# EAGLE design i2c_board (EAGLE 8.4.1)
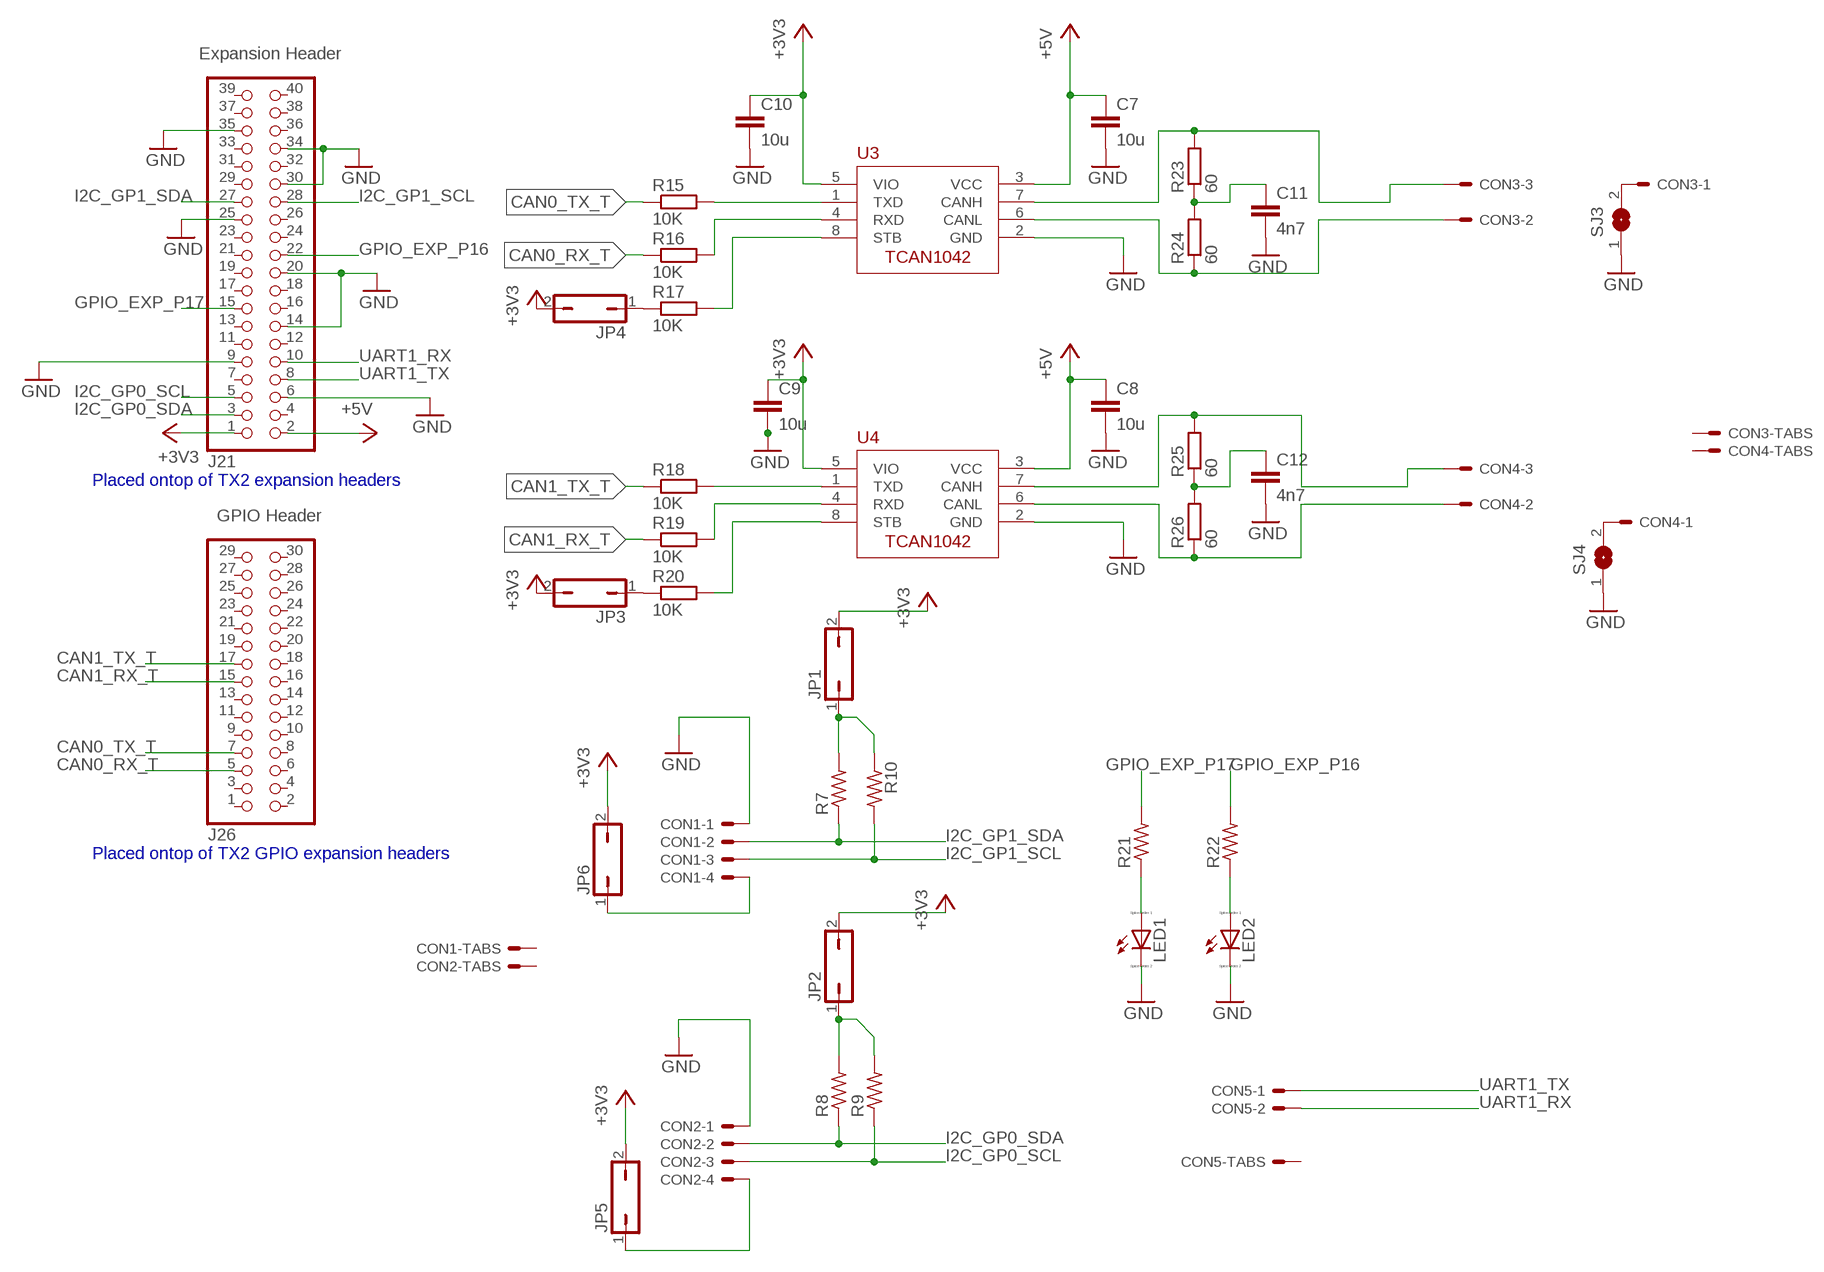
[diagram p0: schematic, sheet 1]

## Parts
C7  10u  C-EUC0805  [C0805]
C8  10u  C-EUC0805  [C0805]
C9  10u  C-EUC0805  [C0805]
C10  10u  C-EUC0805  [C0805]
C11  4n7  C-EUC0805  [C0805]
C12  4n7  C-EUC0805  [C0805]
CON1  SM04B-GHS-TB  [SM04B-GHS-TB]
CON2  SM04B-GHS-TB  [SM04B-GHS-TB]
CON3  SM03B-GHS-TB  [SM03B-GHS-TB]
CON4  SM03B-GHS-TB  [SM03B-GHS-TB]
CON5  SM02B-GHS-TB  [SM02B-GHS-TB]
J21  PINHD-2X20  [2X20]
J26  PINHD-2X15  [2X15]
JP1  JP1Q  [JP1]
JP2  JP1Q  [JP1]
JP3  JP1Q  [JP1]
JP4  JP1Q  [JP1]
JP5  JP1Q  [JP1]
JP6  JP1Q  [JP1]
LED1  LED_E  [LED_1206]
LED2  LED_E  [LED_1206]
R7  R-US_M1206  [M1206]
R8  R-US_M1206  [M1206]
R9  R-US_M1206  [M1206]
R10  R-US_M1206  [M1206]
R15  10K  R-EU_R0805  [R0805]
R16  10K  R-EU_R0805  [R0805]
R17  10K  R-EU_R0805  [R0805]
R18  10K  R-EU_R0805  [R0805]
R19  10K  R-EU_R0805  [R0805]
R20  10K  R-EU_R0805  [R0805]
R21  R-US_M1206  [M1206]
R22  R-US_M1206  [M1206]
R23  60  R-EU_R1206  [R1206]
R24  60  R-EU_R1206  [R1206]
R25  60  R-EU_R1206  [R1206]
R26  60  R-EU_R1206  [R1206]
SJ3  SJ  [SJ]
SJ4  SJ  [SJ]
U3  TCAN1042HVDR  [SO-8]
U4  TCAN1042HVDR  [SO-8]

## Nets
+3V3: C9.1 C10.1 J21.1 JP1.2 JP2.2 JP3.2 JP4.2 JP5.2 JP6.2 U3.5(VIO) U4.5(VIO)
+5V: C7.1 C8.1 J21.2 U3.3(VCC) U4.3(VCC)
CAN0_RX_T: J26.5 R16.1
CAN0_TX_T: J26.7 R15.1
CAN1_RX_T: J26.15 R19.1
CAN1_TX_T: J26.17 R18.1
GND: C7.2 C8.2 C9.2 C10.2 C11.2 C12.2 CON1.P$1 CON2.P$1 J21.6 J21.9 J21.14 J21.20 J21.25 J21.30 J21.34 J21.35 LED1.C LED2.C SJ3.1 SJ4.1 U3.2(GND) U4.2(GND)
GPIO_EXP_P16: J21.22 R22.2
GPIO_EXP_P17: J21.15 R21.2
I2C_GP0_SCL: CON2.P$3 J21.5 R9.1
I2C_GP0_SDA: CON2.P$2 J21.3 R8.1
I2C_GP1_SCL: CON1.P$3 J21.28 R10.2
I2C_GP1_SDA: CON1.P$2 J21.27 R7.1
N$1: JP2.1 R8.2 R9.2
N$2: JP1.1 R7.2 R10.1
N$3: LED1.A R21.1
N$4: LED2.A R22.1
N$5: CON1.P$4 JP6.1
N$6: CON2.P$4 JP5.1
N$19: C11.1 R23.1 R24.2
N$20: C12.1 R25.1 R26.2
N$21: CON4.P$3 R25.2 U4.7(CANH)
N$22: CON4.P$2 R26.1 U4.6(CANL)
N$23: CON3.P$3 R23.2 U3.7(CANH)
N$24: CON3.P$2 R24.1 U3.6(CANL)
N$25: R15.2 U3.1(TXD)
N$26: R16.2 U3.4(RXD)
N$27: R17.2 U3.8(STB)
N$28: R18.2 U4.1(TXD)
N$29: R19.2 U4.4(RXD)
N$30: R20.2 U4.8(STB)
N$31: CON3.P$1 SJ3.2
N$32: CON4.P$1 SJ4.2
N$33: JP4.1 R17.1
N$34: JP3.1 R20.1
UART1_RX: CON5.P$2 J21.10
UART1_TX: CON5.P$1 J21.8
Unconnected: CON1.P$5 CON1.P$6 CON2.P$5 CON2.P$6 CON3.P$4 CON3.P$5 CON4.P$4 CON4.P$5 CON5.P$3 CON5.P$4 J21.4 J21.7 J21.11 J21.12 J21.13 J21.16 J21.17 J21.18 J21.19 J21.21 J21.23 J21.24 J21.26 J21.29 J21.31 J21.32 J21.33 J21.36 J21.37 J21.38 J21.39 J21.40 J26.1 J26.2 J26.3 J26.4 J26.6 J26.8 J26.9 J26.10 J26.11 J26.12 J26.13 J26.14 J26.16 J26.18 J26.19 J26.20 J26.21 J26.22 J26.23 J26.24 J26.25 J26.26 J26.27 J26.28 J26.29 J26.30

## Notes on the sheet
- Expansion Header
- Placed ontop of TX2 expansion headers
- GPIO Header
- Placed ontop of TX2 GPIO expansion headers

## Library data of the parts
C7-C12 = resistor:C-EU: CAPACITOR, European symbol
CON1 CON2 = ARVP:SM04B-GHS-TB
CON3 CON4 = ARVP:SM03B-GHS-TB
CON5 = ARVP:SM02B-GHS-TB
J21 = commhub:PINHD-2X20: PIN HEADER
J26 = commhub:PINHD-2X15: PIN HEADER
JP1-JP6 = jumper:JP1Q: JUMPER
LED1 LED2 = eagle-ltspice:LED_E: LED Source: http://www.osram.convergy.de Source: www.luxeon.com Source: www.kingbright.com; SPICEMODEL: NONE; SPICEPREFIX: D; SPICETYPE: diode
R7-R10 R21 R22 = resistor:R-US_: RESISTOR, American symbol
R15-R20 R23-R26 = resistor:R-EU_: RESISTOR, European symbol
SJ3 SJ4 = jumper:SJ: SMD solder JUMPER
U3 U4 = ARVP:TCAN1042HVDR

## Board
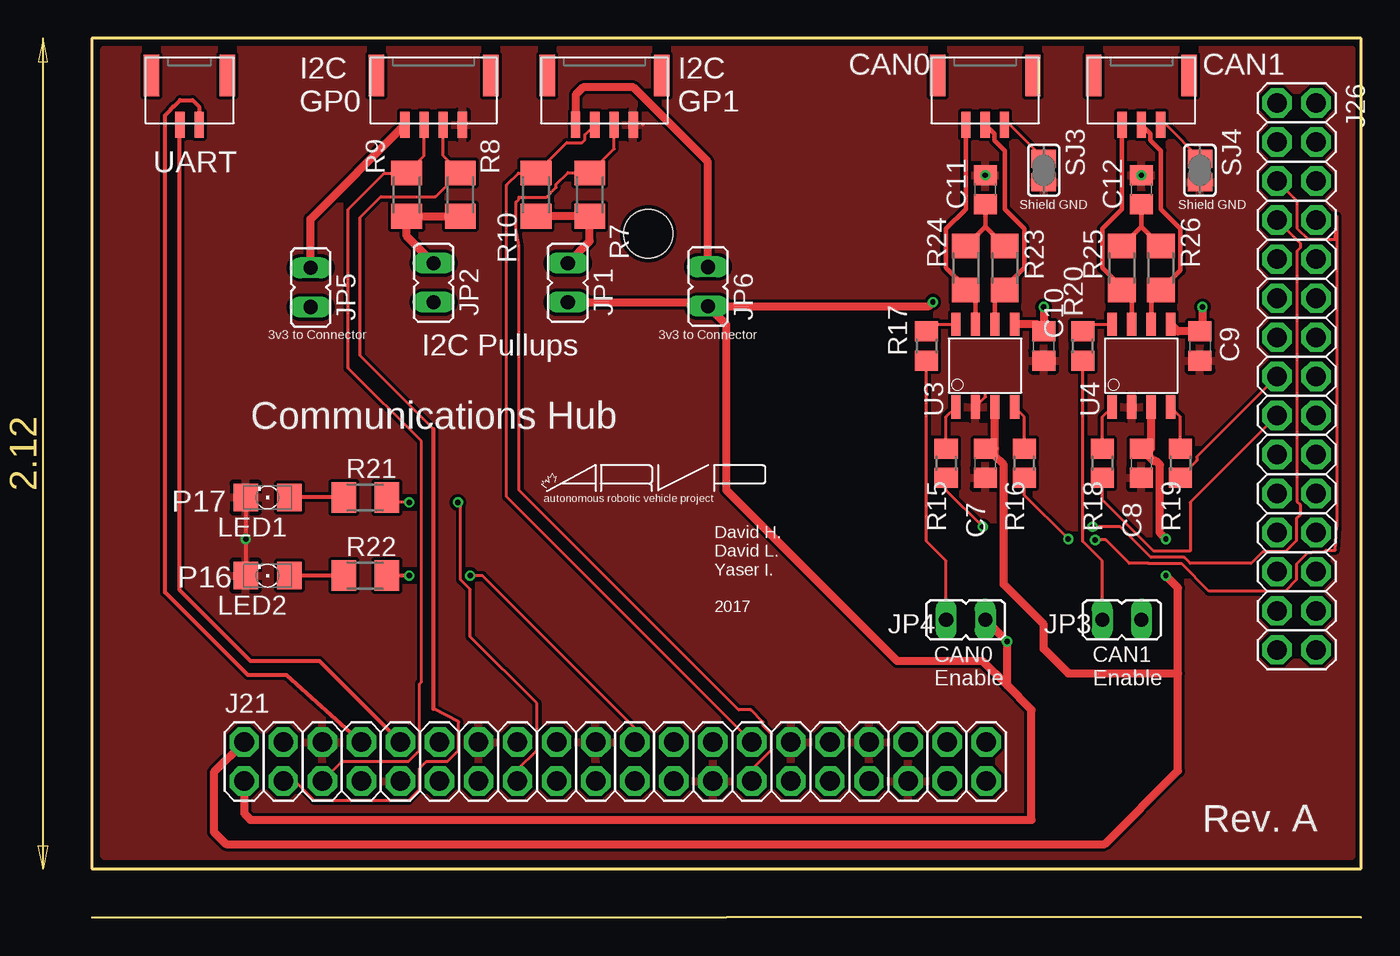
[diagram p1: board, top side]
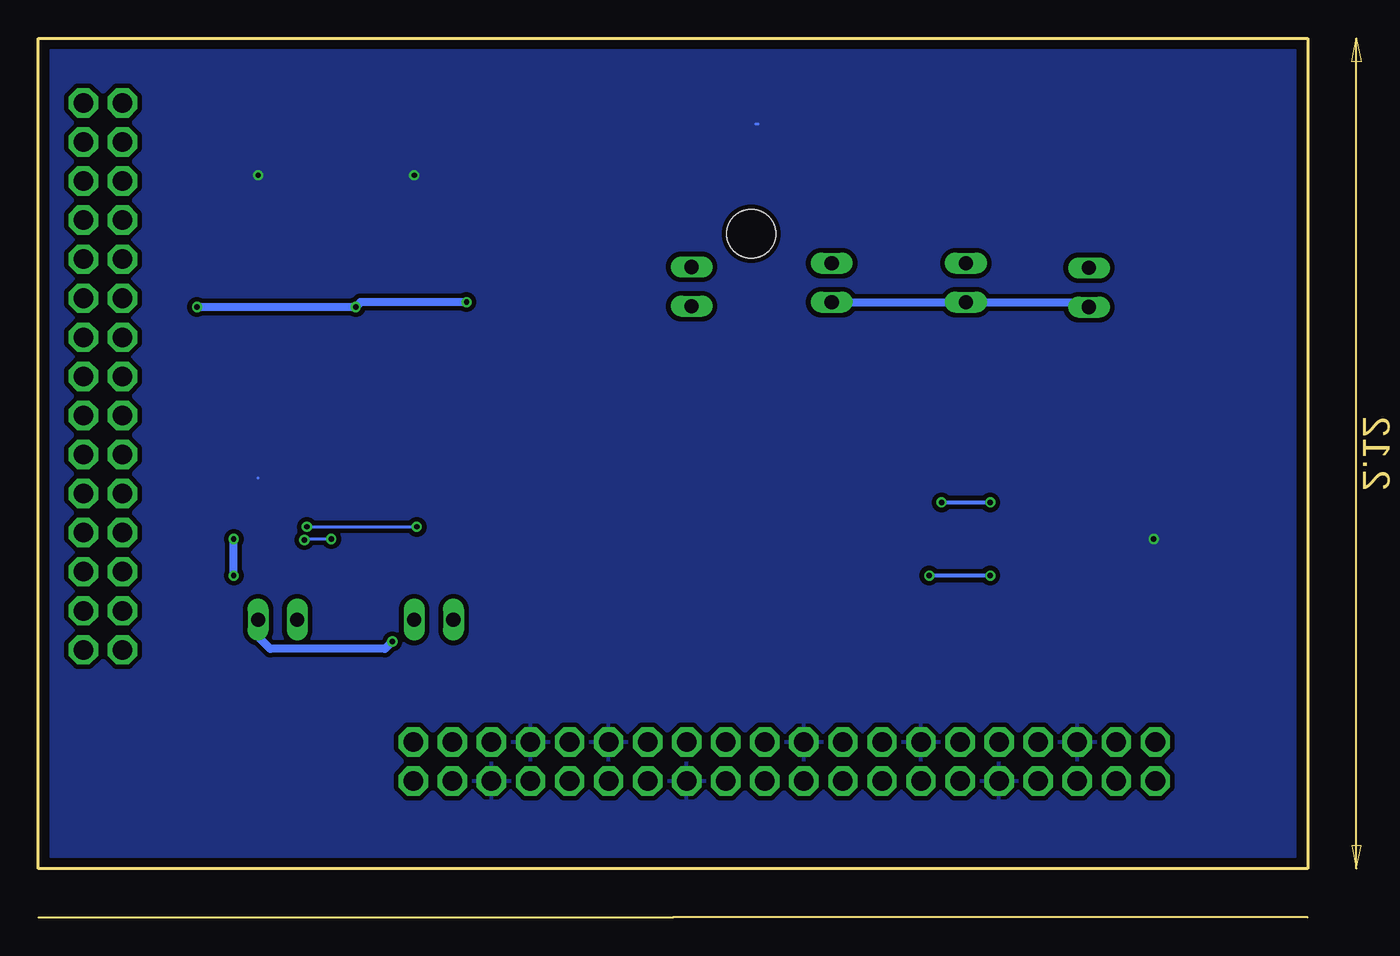
[diagram p2: board, bottom side, seen from below]

Size 82.55 x 53.98 mm. Coordinates in mm from the lower left corner, seen from the top.
Outline: 0,0 82.55,0 82.55,53.98 0,53.98 0,0
Copper layers (1*16): Top 0.035mm / dielectric 1.5mm / Bottom 0.035mm
Design rules "ITEADstudioDRC": minimum track width 6mil, minimum drill 12mil, track to track 8mil, track to pad 8mil, pad to pad 8mil, via to via 8mil, smd to smd 0mil, copper to edge 10mil, drill to drill 10mil, minimum pad ring 6mil, minimum via ring 6mil, stop-mask expansion 2mil, vias tented up to drill 100mil, thermal gap 10mil
Holes 3.17 mm at 36.2,41.27

### Footprints (pad centres in the part's own frame; a part is rotated, then mirrored left to right if it is on the bottom)
C0805 = smd 1.3 x 1.5: 1 -0.95,0; 2 0.95,0
SM04B-GHS-TB = smd 0.6 x 1.7: P$1 -1.875,0.85; P$2 -0.625,0.85; P$3 0.625,0.85; P$4 1.875,0.85 | smd 1 x 2.7: P$5 -3.725,-2.35; P$6 3.725,-2.35
SM03B-GHS-TB = smd 0.6 x 1.7: P$1 -1.25,0.85; P$2 0,0.85; P$3 1.25,0.85 | smd 1 x 2.7: P$4 -3.1,-2.35; P$5 3.1,-2.35
SM02B-GHS-TB = smd 0.6 x 1.7: P$1 -0.625,0.85; P$2 0.625,0.85 | smd 1 x 2.7: P$3 -2.475,-2.35; P$4 2.475,-2.35
2X20 = drill 1.27 octagon: 1 -24.13,-1.27; 2 -24.13,1.27; 3 -21.59,-1.27; 4 -21.59,1.27; 5 -19.05,-1.27; 6 -19.05,1.27; 7 -16.51,-1.27; 8 -16.51,1.27; 9 -13.97,-1.27; 10 -13.97,1.27; 11 -11.43,-1.27; 12 -11.43,1.27; 13 -8.89,-1.27; 14 -8.89,1.27; 15 -6.35,-1.27; 16 -6.35,1.27; 17 -3.81,-1.27; 18 -3.81,1.27; 19 -1.27,-1.27; 20 -1.27,1.27; 21 1.27,-1.27; 22 1.27,1.27; 23 3.81,-1.27; 24 3.81,1.27; 25 6.35,-1.27; 26 6.35,1.27; 27 8.89,-1.27; 28 8.89,1.27; 29 11.43,-1.27; 30 11.43,1.27; 31 13.97,-1.27; 32 13.97,1.27; 33 16.51,-1.27; 34 16.51,1.27; 35 19.05,-1.27; 36 19.05,1.27; 37 21.59,-1.27; 38 21.59,1.27; 39 24.13,-1.27; 40 24.13,1.27
2X15 = drill 1.27 octagon: 1 -17.78,-1.27; 2 -17.78,1.27; 3 -15.24,-1.27; 4 -15.24,1.27; 5 -12.7,-1.27; 6 -12.7,1.27; 7 -10.16,-1.27; 8 -10.16,1.27; 9 -7.62,-1.27; 10 -7.62,1.27; 11 -5.08,-1.27; 12 -5.08,1.27; 13 -2.54,-1.27; 14 -2.54,1.27; 15 0,-1.27; 16 0,1.27; 17 2.54,-1.27; 18 2.54,1.27; 19 5.08,-1.27; 20 5.08,1.27; 21 7.62,-1.27; 22 7.62,1.27; 23 10.16,-1.27; 24 10.16,1.27; 25 12.7,-1.27; 26 12.7,1.27; 27 15.24,-1.27; 28 15.24,1.27; 29 17.78,-1.27; 30 17.78,1.27
JP1 = drill 0.914 long: 1 0,-1.27; 2 0,1.27
LED_1206 = smd 1.6 x 1.803: A -1.422,0; C 1.422,0
M1206 = smd 1.6 x 2: 1 -1.4,0; 2 1.4,0
R0805 = smd 1.3 x 1.5: 1 -0.95,0; 2 0.95,0
R1206 = smd 1.6 x 1.803: 1 -1.422,0; 2 1.422,0
SJ = smd 1.168 x 1.6: 1 -0.762,0; 2 0.762,0
SO-8 = smd 1.524 x 0.61: 1 -2.692,1.905; 2 -2.692,0.635; 3 -2.692,-0.635; 4 -2.692,-1.905; 5 2.692,-1.905; 6 2.692,-0.635; 7 2.692,0.635; 8 2.692,1.905

### Placement (x,y rotation side)
C7  58.1,26.35 270 top
C8  68.26,26.35 270 top
C9  72.07,33.97 270 top
C10  61.91,33.97 270 top
C11  58.1,44.13 90 top
C12  68.26,44.13 90 top
CON1  33.34,49.21 180 top
CON2  22.23,49.21 180 top
CON3  58.1,49.21 180 top
CON4  68.26,49.21 180 top
CON5  6.35,49.21 180 top
J21  34.04,6.96 0 top
J26  78.36,32 270 top
JP1  30.96,38.1 180 top
JP2  22.23,38.1 180 top
JP3  66.99,16.19 270 top
JP4  56.83,16.19 270 top
JP5  14.22,37.78 180 top
JP6  40.07,37.85 180 top
LED1  11.43,24.13 180 top
LED2  11.43,19.05 180 top
R7  32.38,43.81 270 top
R8  23.97,43.81 270 top
R9  20.48,43.81 270 top
R10  28.89,43.81 90 top
R15  55.56,26.35 90 top
R16  60.64,26.35 90 top
R17  54.29,33.97 90 top
R18  65.72,26.35 90 top
R19  70.8,26.35 90 top
R20  64.45,33.97 90 top
R21  17.78,24.13 0 top
R22  17.78,19.05 0 top
R23  56.83,39.05 270 top
R24  59.37,39.05 90 top
R25  66.99,39.05 270 top
R26  69.53,39.05 90 top
SJ3  61.91,45.4 90 top
SJ4  72.07,45.4 90 top
U3  58.1,32.7 90 top
U4  68.26,32.7 90 top
U$1  [ARVP]  29.37,23.81 0 top

### Tracks (layer width: path | path; a pad name or v marks a point on that pad's centre or on a via)
+3V3  (via drill 0.35)
  Top 0.305: C10.1
  Top 0.508: 9.87,4.9 J21.1 9.91,3.59 10.32,3.17 61.12,3.17 61.12,10.32 59.53,11.91 | 59.53,11.91 v59.53,14.76 JP4.2 | 59.53,11.91 57.94,13.49 52.39,13.49 41.27,24.61 41.27,35.37 JP6.2 | v61.91,36.51 C10.1 | C10.1 61.44,35.4 U3.5 | v72.23,36.51 72.23,35.08 C9.1 70.64,34.92 U4.5 | JP1.2 39.81,36.83 JP6.2 | JP6.2 54.45,36.58 v54.71,36.83
  Bottom 0.508: v59.53,14.76 60.01,14.29 67.47,14.29 68.26,15.08 JP3.2 | JP1.2 JP2.2 14.54,36.83 JP5.2 | v54.71,36.83 61.59,36.83 v61.91,36.51 v72.23,36.51
+5V  (via drill 0.35)
  Top 0.406: C8.1 68.9,27.3 | 58.74,27.3 C7.1
  Top 0.508: 68.9,27.3 U4.3 | U3.3 58.74,27.3 58.74,26.81 59.31,26.24 59.31,18.48 61.91,15.88 61.91,14.29 63.5,12.7 70.64,12.7 | J21.2 7.94,6.26 7.94,2.38 8.73,1.59 65.88,1.59 70.64,6.35 70.64,12.7 | v69.85,19.05 70.64,18.26 70.64,12.7 | C8.1 69.06,26.51 69.2,26.51 69.47,26.24 69.47,21.81 v69.85,21.43
  Bottom 0.508: v69.85,19.05 v69.85,21.43
CAN0_RX_T  (via drill 0.35)
  Top 0.203: J26.5 78.37,43.42 78.37,41.64 79.11,40.91 80.89,40.91 80.96,42.42 80.96,22.23 80.89,20.71 80.28,20.71 80.15,20.59 79.38,20.59 79.36,20.56 79.11,20.56 78.35,19.8 78.35,18.78 77.61,18.05 72.66,18.05 70.88,19.82 68.72,19.82 68.7,19.84 67.47,19.84 65.94,21.37 v65.25,21.37 | v63.5,21.43 60.64,24.29 R16.1
  Bottom 0.203: v65.25,21.37 65.19,21.43 v63.5,21.43
CAN0_TX_T  (via drill 0.35)
  Top 0.203: J26.7 78.58,40.67 78.58,40.35 78.37,40.15 78.37,23.86 78.58,23.65 78.58,23.02 78.35,22.78 78.35,21.32 77.61,20.59 76.15,20.59 75.41,19.84 71.44,19.84 71.05,20.23 68.89,20.23 66.89,22.23 v65.09,22.23 | v57.94,22.23 55.56,24.61 R15.1
  Bottom 0.203: v65.09,22.23 v57.94,22.23
CAN1_RX_T
  Top 0.203: J26.15 71.86,26.77 71.86,26.53 70.8,25.47 R19.1
CAN1_TX_T
  Top 0.203: J26.17 71.44,23.81 71.44,20.64 69.06,20.64 65.72,23.97 R18.1
GND  (via drill 0.35)
  Top 0.203: 35.82,48.36 35.88,48.42 | U3.2 58.13,30.67 58.13,30.9
  Top 0.254: LED1.C v10.01,21.43 LED2.C
  Bottom 0.203: 35.88,48.42 35.72,48.42 | C8.2 | C11.2 57.94,45.24 | C12.2 68.26,45.24
  other vias: 58.1,45.08 68.26,45.08
  pour Bottom (isolate 0.305): 0.79,53.18 81.76,53.18 81.76,0.79 0.79,0.79
  pour Top: 0.82,53.24 81.92,53.24 81.92,0.82 0.82,0.82
GPIO_EXP_P16  (via drill 0.35)
  Top 0.203: J21.22 35.31,9.14 25.4,19.05 v24.61,19.05
  Top 0.254: v20.64,19.05 R22.2
  Bottom 0.254: v20.64,19.05 v24.61,19.05
GPIO_EXP_P17  (via drill 0.35)
  Top 0.203: v23.81,23.81 23.97,23.65 23.97,18.79 24.61,18.16 24.61,15.08 28.94,10.74 28.94,7.71 27.69,6.45 J21.15 | v20.64,23.81 19.5,23.81 R21.2
  Top 0.254: 27.69,6.45 J21.15
  Bottom 0.254: v23.81,23.81 v20.64,23.81
I2C_GP0_SCL
  Top 0.203: CON2.P$3 21.6,46.34 R9.1 19.02,45.22 16.67,42.86 16.67,32.54 21.43,27.78 21.43,12.13 21.32,12.03 21.32,7.71 20.59,6.97 16.27,6.97 J21.5
I2C_GP0_SDA
  Top 0.203: CON2.P$2 22.85,46.34 R8.1 23.88,45.22 | J21.3 13.21,5.69 14.46,4.43 20.59,4.43 21.32,5.17 21.32,6.53 21.76,6.97 23.13,6.97 23.86,7.71 23.86,9.54 22.23,10.39 | 22.23,28.57 17.46,33.34 17.46,42.35 18.8,43.69 22.35,43.69 23.88,45.22 | 23.88,45.22 23.37,45.22
  Top 0.254: 22.23,10.39 22.23,28.57
I2C_GP1_SCL
  Top 0.203: CON1.P$3 32.07,47.72 32.07,47.39 31.89,47.21 30.89,47.21 R10.2 27.75,45.22 26.99,44.45 26.99,24.17 J21.28
I2C_GP1_SDA
  Top 0.203: J21.27 42.93,6.45 44.21,7.73 44.21,8.73 | CON1.P$2 33.96,46.79 R7.1 32.36,45.24 30.96,45.24 30.2,44.48 30.2,44.29 29.57,43.66 27.78,43.66 27.78,43.53 27.59,43.34 27.59,41.49 27.78,40.5 27.78,24.61 42.07,10.32 42.86,10.32 43.66,9.53 43.66,9.28 44.21,8.73 | 44.21,8.73 44.21,8.75
N$1
  Top 0.508: JP2.1 20.48,41.12 R9.2 R8.2
N$2
  Top 0.508: JP1.1 32.38,40.8 R7.2 R10.1
N$3
  Top 0.254: R21.1 LED1.A
N$4
  Top 0.254: R22.1 LED2.A
N$5
  Top 0.508: JP6.1 40.07,45.94 35.22,50.79 31.95,50.79 31.46,50.3 CON1.P$4
N$6
  Top 0.508: JP5.1 14.22,42.23 CON2.P$4
N$19
  Top 0.305: C11.1 58.1,41.74 | 58.1,41.74 R24.2 | 58.1,41.74 R23.1
N$20
  Top 0.305: C12.1 68.26,41.74 | 68.26,41.74 R26.2 | 68.26,41.74 R25.1
N$21
  Top 0.305: 66.99,37.78 R25.2 | 66.99,37.78 65.72,39.05 65.72,41.59 66.99,42.86 66.99,48.34 CON4.P$3 | U4.7 67.63,37.78 66.99,37.78
N$22
  Top 0.305: 69.61,37.71 R26.1 | 69.61,37.71 70.8,38.9 70.8,41.59 69.53,42.86 69.53,46.69 68.86,47.37 68.86,47.77 CON4.P$2 | U4.6 68.9,37.71 69.61,37.71
N$23
  Top 0.305: U3.7 57.47,37.63 R23.2 56.83,37.78 55.56,39.05 55.56,41.59 56.83,42.86 56.83,48.34 CON3.P$3
N$24
  Top 0.305: 59.37,37.78 R24.1 | 59.37,37.78 60.64,39.05 60.64,41.59 59.37,42.86 59.37,46.69 58.7,47.37 58.7,47.77 CON3.P$2 | U3.6 58.74,37.78 59.37,37.78
N$25
  Top 0.203: R15.2 55.56,29.38 U3.1
N$26
  Top 0.203: R16.2 60.64,29.38 U3.4
N$27
  Top 0.203: R17.2 54.77,35.4 U3.8
N$28
  Top 0.203: R18.2 65.72,29.38 U4.1
N$29
  Top 0.203: R19.2 70.8,29.38 U4.4
N$30
  Top 0.203: R20.2 64.92,35.4 U4.8
N$31
  Top 0.203: SJ3.2 59.72,48.36 CON3.P$1
N$32
  Top 0.203: SJ4.2 69.87,48.36 CON4.P$1
N$33
  Top 0.203: JP4.1 55.56,20 54.29,21.27 R17.1
N$34
  Top 0.203: JP3.1 65.72,20 64.45,21.27 R20.1
UART1_RX
  Top 0.254: J21.10 14.8,13.49 10.32,13.49 5.72,18.09 CON5.P$2
UART1_TX
  Top 0.254: J21.8 12.67,12.58 10.15,12.58 4.76,17.97 4.76,48.98 5.09,49.31 5.09,49.35 5.29,49.54 5.31,49.54 5.73,49.97 6.55,49.97 6.97,49.55 CON5.P$1

### Text on the board
tSilk: CAN0 | CAN1 | I2C / GP0 | I2C / GP1 | UART | Shield GND | Shield GND | 3v3 to Connector | 3v3 to Connector | I2C Pullups | Communications Hub | P17 | David H. / David L. / Yaser I. | P16 | 2017 | CAN0 / Enable | CAN1 / Enable | Rev. A